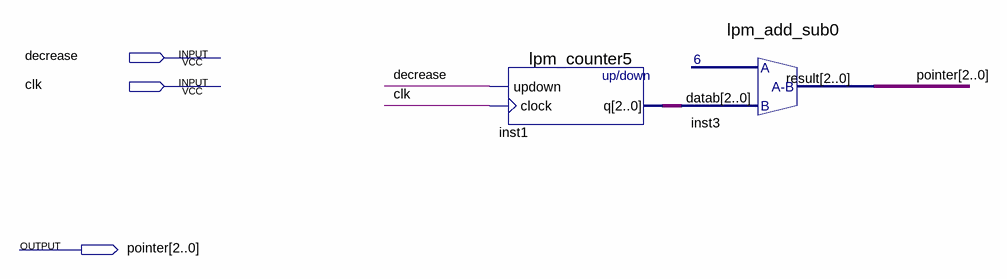
[diagram p0: schematic sheet]
// Quartus schematic StackPointer.bdf as structural Verilog: 2 symbols, 3 pins
module StackPointer (
  input  decrease,
  input  clk,
  output [2:0] pointer
);

  wire [2:0] inst1_q;

  lpm_counter5 inst1 (.updown(decrease), .clock(clk), .q(inst1_q));
  lpm_add_sub0 inst3 (.datab(inst1_q), .result(pointer));
endmodule
